# EAGLE schematic PCB-2x8GPIO (EAGLE 6.4)
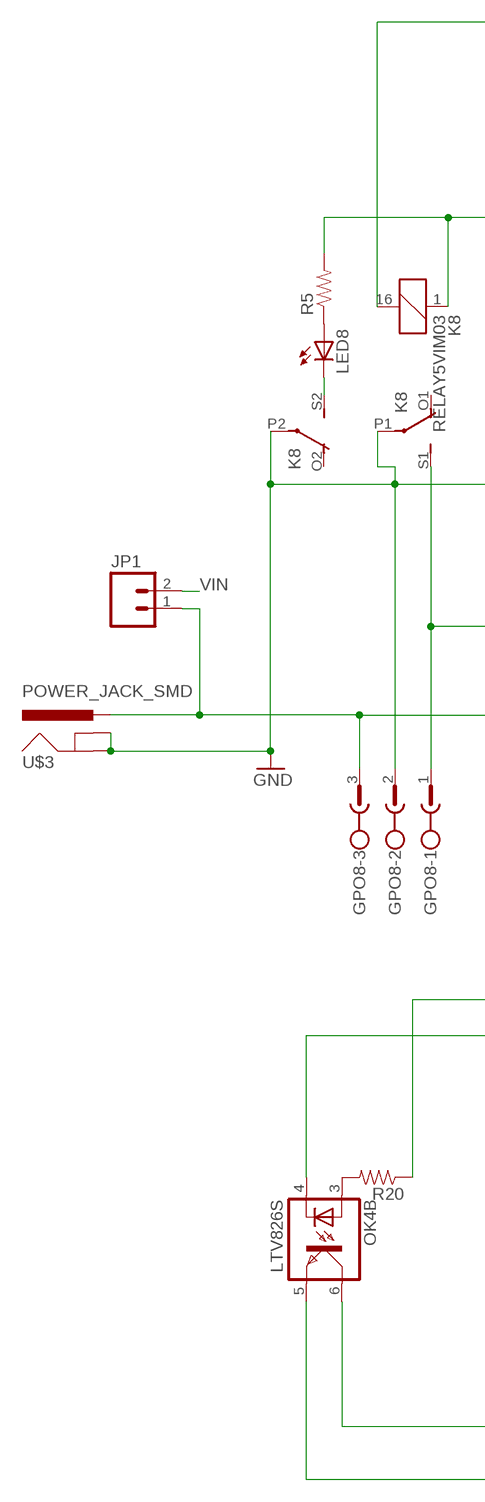
[diagram p0: schematic, sheet 1, part 1 of 2]
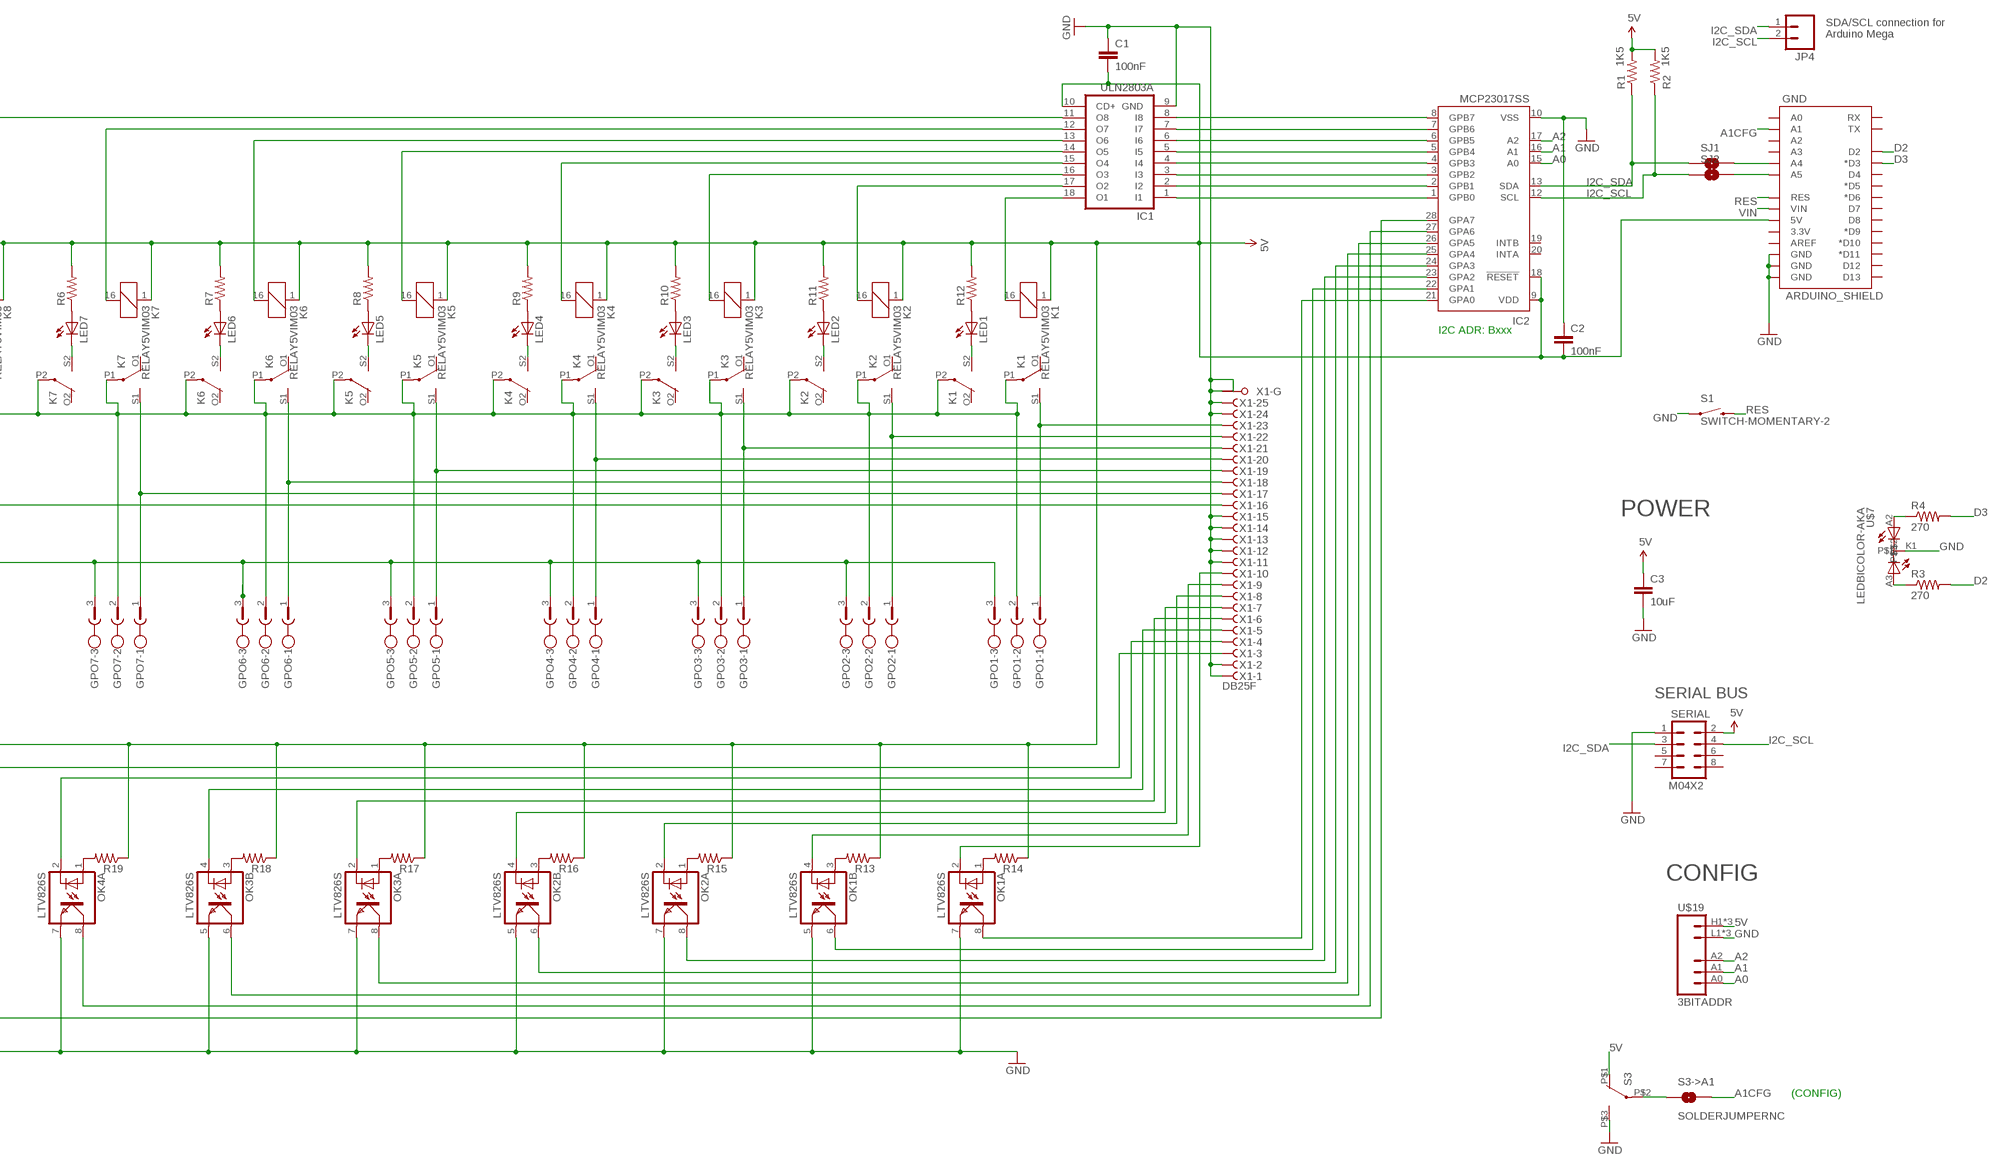
[diagram p1: schematic, sheet 1, part 2 of 2]

## Parts
C1  100nF  CAP0805  [0805]
C2  100nF  CAP0603-CAP  [0603-CAP]
C3  10uF  CAP0805  [0805]
GND  ARDUINO_SHIELD  [ARDUINO_BOXSHIELD_NOHOLES]
GPO1  CON1  MSTBV3  [MSTBV3]
GPO2  CON1  MSTBV3  [MSTBV3]
GPO3  CON1  MSTBV3  [MSTBV3]
GPO4  CON1  MSTBV3  [MSTBV3]
GPO5  CON1  MSTBV3  [MSTBV3]
GPO6  CON1  MSTBV3  [MSTBV3]
GPO7  CON1  MSTBV3  [MSTBV3]
GPO8  GPO8  MSTBV3  [MSTBV3]
IC1  ULN2803A  ULN2803ASO18W  [SO18W]
IC2  MCP23017SS  [SSOP28]
JP1  M02LOCK  [1X02_LOCK]
JP4  M02PTH  [1X02]
K1  RELAY5VIM03  [DS2Y]
K2  RELAY5VIM03  [DS2Y]
K3  RELAY5VIM03  [DS2Y]
K4  RELAY5VIM03  [DS2Y]
K5  RELAY5VIM03  [DS2Y]
K6  RELAY5VIM03  [DS2Y]
K7  RELAY5VIM03  [DS2Y]
K8  RELAY5VIM03  [DS2Y]
LED1  LED0603  [LED-0603]
LED2  LED0603  [LED-0603]
LED3  LED0603  [LED-0603]
LED4  LED0603  [LED-0603]
LED5  LED0603  [LED-0603]
LED6  LED0603  [LED-0603]
LED7  LED0603  [LED-0603]
LED8  LED0603  [LED-0603]
OK1  LTV826S  [DIL8-SMD]
OK2  LTV826S  [DIL8-SMD]
OK3  LTV826S  [DIL8-SMD]
OK4  LTV826S  [DIL8-SMD]
R1  1K5  RESISTOR0603-RES  [0603-RES]
R2  1K5  RESISTOR0603-RES  [0603-RES]
R3  270  RESISTOR0603-RES  [0603-RES]
R4  270  RESISTOR0603-RES  [0603-RES]
R5  RESISTOR0603-RES  [0603-RES]
R6  RESISTOR0603-RES  [0603-RES]
R7  RESISTOR0603-RES  [0603-RES]
R8  RESISTOR0603-RES  [0603-RES]
R9  RESISTOR0603-RES  [0603-RES]
R10  RESISTOR0603-RES  [0603-RES]
R11  RESISTOR0603-RES  [0603-RES]
R12  RESISTOR0603-RES  [0603-RES]
R13  RESISTOR0603-RES  [0603-RES]
R14  RESISTOR0603-RES  [0603-RES]
R15  RESISTOR0603-RES  [0603-RES]
R16  RESISTOR0603-RES  [0603-RES]
R17  RESISTOR0603-RES  [0603-RES]
R18  RESISTOR0603-RES  [0603-RES]
R19  RESISTOR0603-RES  [0603-RES]
R20  RESISTOR0603-RES  [0603-RES]
S1  SWITCH-MOMENTARY-2  [TACTILE_SWITCH_TALL]
S3  CFG  SWITCH-DPST  [TECONNECTIVITY-DPST]
S3->A1  SOLDERJUMPERNC  [SJ_2S]
SERIAL  M04X2  [2X4]
SJ1  SOLDERJUMPERNC  [SJ_2S]
SJ2  SOLDERJUMPERNC  [SJ_2S]
U$3  POWER_JACK_SMD  [POWER_JACK_SMD]
U$7  LEDBICOLOR-AKA  [LED5MM-BICOLOR]
U$19  3BITADDR  [3BITADDR]
X1  DB25F  F25HPS  [F25HP]

## Nets
5V [PWR]: C1.2 C2.2 C3.1 GND.5V@0(5V) IC1.10(CD+) IC2.9(VDD) IC2.18(!RESET) K1.1 K2.1 K3.1 K4.1 K5.1 K6.1 K7.1 K8.1 R1.2 R2.2 R5.2 R6.2 R7.2 R8.2 R9.2 R10.2 R11.2 R12.2 R13.1 R14.1 R15.1 R16.1 R17.1 R18.1 R19.1 R20.1 S3.P$1(O) SERIAL.2 U$19.H1(VCC) U$19.H2(VCC) U$19.H3(VCC)
A0: IC2.15(A0) U$19.A0
A1: IC2.16(A1) U$19.A1
A1CFG: GND.A1 S3->A1.2
A2: IC2.17(A2) U$19.A2
D2: GND.2(D2) R3.2
D3: GND.3(*D3) R4.2
GND [PWR]: C1.1 C2.1 C3.2 GND.GND@0(GND) GND.GND@1(GND) GND.GND@4(GND) GPO1.2 GPO2.2 GPO3.2 GPO4.2 GPO5.2 GPO6.2 GPO7.2 GPO8.2 IC1.9(GND) IC2.10(VSS) K1.P1(2:P) K1.P2(3:P) K2.P1(2:P) K2.P2(3:P) K3.P1(2:P) K3.P2(3:P) K4.P1(2:P) K4.P2(3:P) K5.P1(2:P) K5.P2(3:P) K6.P1(2:P) K6.P2(3:P) K7.P1(2:P) K7.P2(3:P) K8.P1(2:P) K8.P2(3:P) OK1.5(B:EMIT) OK1.7(A:EMIT) OK2.5(B:EMIT) OK2.7(A:EMIT) OK3.5(B:EMIT) OK3.7(A:EMIT) OK4.5(B:EMIT) OK4.7(A:EMIT) S1.A2 S3.P$3(S) SERIAL.1 U$3.GND U$3.SHUNT(GNDBREAK) U$7.K1 U$19.L1(GND) U$19.L2(GND) U$19.L3(GND) X1.1(-1:F) X1.2(-2:F) X1.11(-11:F) X1.12(-12:F) X1.13(-13:F) X1.14(-14:F) X1.15(-15:F) X1.24(-24:F) X1.25(-25:F) X1.G1(-G:G1) X1.G2(-G:G2)
I2C_SCL: IC2.12(SCL) JP4.2 R2.1 SERIAL.4 SJ2.1
I2C_SDA: IC2.13(SDA) JP4.1 R1.1 SERIAL.3 SJ1.1
N$1 [RELAY LINES]: GPO1.1 K1.S1(2:S) X1.23(-23:F)
N$2: S3->A1.1 S3.P$2(P)
N$3: K1.S2(3:S) LED1.C
N$4: IC1.18(O1) K1.16
N$5: IC1.1(I1) IC2.1(GPB0)
N$6 [RELAY LINES]: GPO2.1 K2.S1(2:S) X1.22(-22:F)
N$7: R4.1 U$7.A2
N$8: K2.S2(3:S) LED2.C
N$9: IC1.17(O2) K2.16
N$10 [RELAY LINES]: GPO3.1 K3.S1(2:S) X1.21(-21:F)
N$11: R3.1 U$7.A3
N$12: K3.S2(3:S) LED3.C
N$13: IC1.16(O3) K3.16
N$14 [RELAY LINES]: GPO4.1 K4.S1(2:S) X1.20(-20:F)
N$15: LED8.A R5.1
N$16: K4.S2(3:S) LED4.C
N$17: IC1.15(O4) K4.16
N$18 [RELAY LINES]: GPO5.1 K5.S1(2:S) X1.19(-19:F)
N$19: GND.A4 SJ1.2
N$20: K5.S2(3:S) LED5.C
N$21: IC1.14(O5) K5.16
N$22 [RELAY LINES]: GPO6.1 K6.S1(2:S) X1.18(-18:F)
N$23: GND.A5 SJ2.2
N$24: K6.S2(3:S) LED6.C
N$25: IC1.13(O6) K6.16
N$26 [RELAY LINES]: GPO7.1 K7.S1(2:S) X1.17(-17:F)
N$27: LED7.A R6.1
N$28: K7.S2(3:S) LED7.C
N$29: IC1.12(O7) K7.16
N$30 [RELAY LINES]: GPO8.1 K8.S1(2:S) X1.16(-16:F)
N$31 [PWR]: GPO1.3 GPO2.3 GPO3.3 GPO4.3 GPO5.3 GPO6.3 GPO7.3 GPO8.3 JP1.1 U$3.PWR
N$32: K8.S2(3:S) LED8.C
N$33: IC1.11(O8) K8.16
N$34: IC1.2(I2) IC2.2(GPB1)
N$35: IC1.3(I3) IC2.3(GPB2)
N$36: IC1.4(I4) IC2.4(GPB3)
N$37: IC1.5(I5) IC2.5(GPB4)
N$38: IC1.6(I6) IC2.6(GPB5)
N$39: IC1.7(I7) IC2.7(GPB6)
N$40: IC1.8(I8) IC2.8(GPB7)
N$41: LED6.A R7.1
N$42: LED5.A R8.1
N$43: LED4.A R9.1
N$44: LED3.A R10.1
N$45: LED2.A R11.1
N$46: LED1.A R12.1
N$47: OK1.3(B:A) R13.2
N$48: OK1.1(A:A) R14.2
N$49 [INput lines]: OK1.2(A:C) X1.10(-10:F)
N$50: OK2.1(A:A) R15.2
N$51: IC2.21(GPA0) OK1.8(A:COL)
N$52: OK2.3(B:A) R16.2
N$53: OK3.1(A:A) R17.2
N$54: OK3.3(B:A) R18.2
N$55 [INput lines]: OK3.2(A:C) X1.6(-6:F)
N$56: OK4.1(A:A) R19.2
N$57: OK4.3(B:A) R20.2
N$60 [INput lines]: OK1.4(B:C) X1.9(-9:F)
N$61 [INput lines]: OK2.2(A:C) X1.8(-8:F)
N$62 [INput lines]: OK2.4(B:C) X1.7(-7:F)
N$63: IC2.28(GPA7) OK4.6(B:COL)
N$64 [INput lines]: OK3.4(B:C) X1.5(-5:F)
N$65 [INput lines]: OK4.2(A:C) X1.4(-4:F)
N$66 [INput lines]: OK4.4(B:C) X1.3(-3:F)
N$68: IC2.22(GPA1) OK1.6(B:COL)
N$69: IC2.23(GPA2) OK2.8(A:COL)
N$70: IC2.24(GPA3) OK2.6(B:COL)
N$71: IC2.25(GPA4) OK3.8(A:COL)
N$72: IC2.26(GPA5) OK3.6(B:COL)
N$73: IC2.27(GPA6) OK4.8(A:COL)
RES: GND.RESET(RES) S1.B2
VIN: GND.VIN JP1.2
Unconnected: GND.0(RX) GND.1(TX) GND.3.3V GND.4(D4) GND.5(*D5) GND.6(*D6) GND.7(D7) GND.8(D8) GND.9(*D9) GND.10(*D10) GND.11(*D11) GND.12(D12) GND.13(D13) GND.A0 GND.A2 GND.A3 GND.AREF IC2.19(INTB) IC2.20(INTA) K1.O1(2:O) K1.O2(3:O) K2.O1(2:O) K2.O2(3:O) K3.O1(2:O) K3.O2(3:O) K4.O1(2:O) K4.O2(3:O) K5.O1(2:O) K5.O2(3:O) K6.O1(2:O) K6.O2(3:O) K7.O1(2:O) K7.O2(3:O) K8.O1(2:O) K8.O2(3:O) SERIAL.5 SERIAL.6 SERIAL.7 SERIAL.8

## Notes on the sheet
- SDA/SCL connection for
- Arduino Mega
- I2C ADR: Bxxx
- POWER
- SERIAL BUS
- CONFIG
- (CONFIG)

## Library data of the parts
C1-C3 = SparkFun:CAP: Capacitor Standard 0603 ceramic capacitor, and 0.1" leaded capacitor.
GND = SKAARHOJ:ARDUINO_SHIELD
GPO1-GPO8 = con-phoenix-508:MSTBV3: PHOENIX; MPN: MSTBV 2,5/3-GF-5.08; OC_FARNELL: 1792793; OC_NEWARK: 69R9846
IC1 = uln-udn:ULN2803A: DRIVER ARRAY
IC2 = microchip:MCP23017: http://ww1.microchip.com/downloads/en/DeviceDoc/21952a.pdf Source: http://ww1.microchip.com/downloads/en/DeviceDoc/21952a.pdf; MF: MICROCHIP; MPN: MCP23017-E/SS; OC_FARNELL: 1467674; OC_NEWARK: 31K2960
JP1 JP4 = SparkFun:M02: Header 2 Standard 2-pin 0.1" header. Use with straight break away headers (SKU : PRT-00116), right angle break away headers (PRT-00553), swiss pins (PRT-00743), machine pins (PRT-00117), and female headers (PRT-00115). Molex polarized connector foot print use with SKU : PRT-08233 with associated crimp pins and housings.
K1-K8 = SKAARHOJ:RELAY5V: RELAY 2 x switch, AxiCom 150 mW 5V
LED1-LED8 = SparkFun:LED: LEDs Standard schematic elements and footprints for 5mm, 3mm, 1206, and 0603 sized LEDs. 5mm - Spark Fun Electronics SKU : COM-00529 (and others)
OK1-OK4 = optocoupler:LTV826: OPTO COUPLER Source: LITEON, LTV816.pdf; OC_FARNELL: unknown; OC_NEWARK: unknown
R1-R20 = SparkFun:RESISTOR: Resistor Basic schematic elements and footprints for 0603, 1206, and PTH resistors.
S1 = SparkFun:SWITCH-MOMENTARY-2
S3 = SKAARHOJ:SWITCH-DPST: DPDT Version of the COM-00597
S3->A1 SJ1 SJ2 = SparkFun:SOLDERJUMPER: Solder Jumper Standard SMD solder jumper. Used to automate production. Two varients : Normally Open and Normally Closed are the same, but have different paste layers. NC will have a large amount of paste and should jumper during reflow.
SERIAL = SparkFun:M04X2
U$3 = SKAARHOJ:POWER_JACK_SMD: RASM712PX Right Angle SMT Mount DC Power Jack, pin size 0.100"(2.5mm), with locating post Switchcraft.com
U$7 = SKAARHOJ:LEDBICOLOR-AKA
U$19 = SKAARHOJ:3BITADDR
X1 = con-subd:F25HPS: SUB-D; OC_FARNELL: unknown; OC_NEWARK: unknown

## Net classes
0 default: width 0.203 mm, drill 0.406 mm, clearance 0.203 mm
1 PWR: width 0.406 mm, drill 0.61 mm, clearance 0.203 mm
2 RELAY LINES: width 0.305 mm, clearance 0.203 mm
3 INput lines: clearance 0.203 mm